# EAGLE design OneHandedPiano (EAGLE 9.6.2)
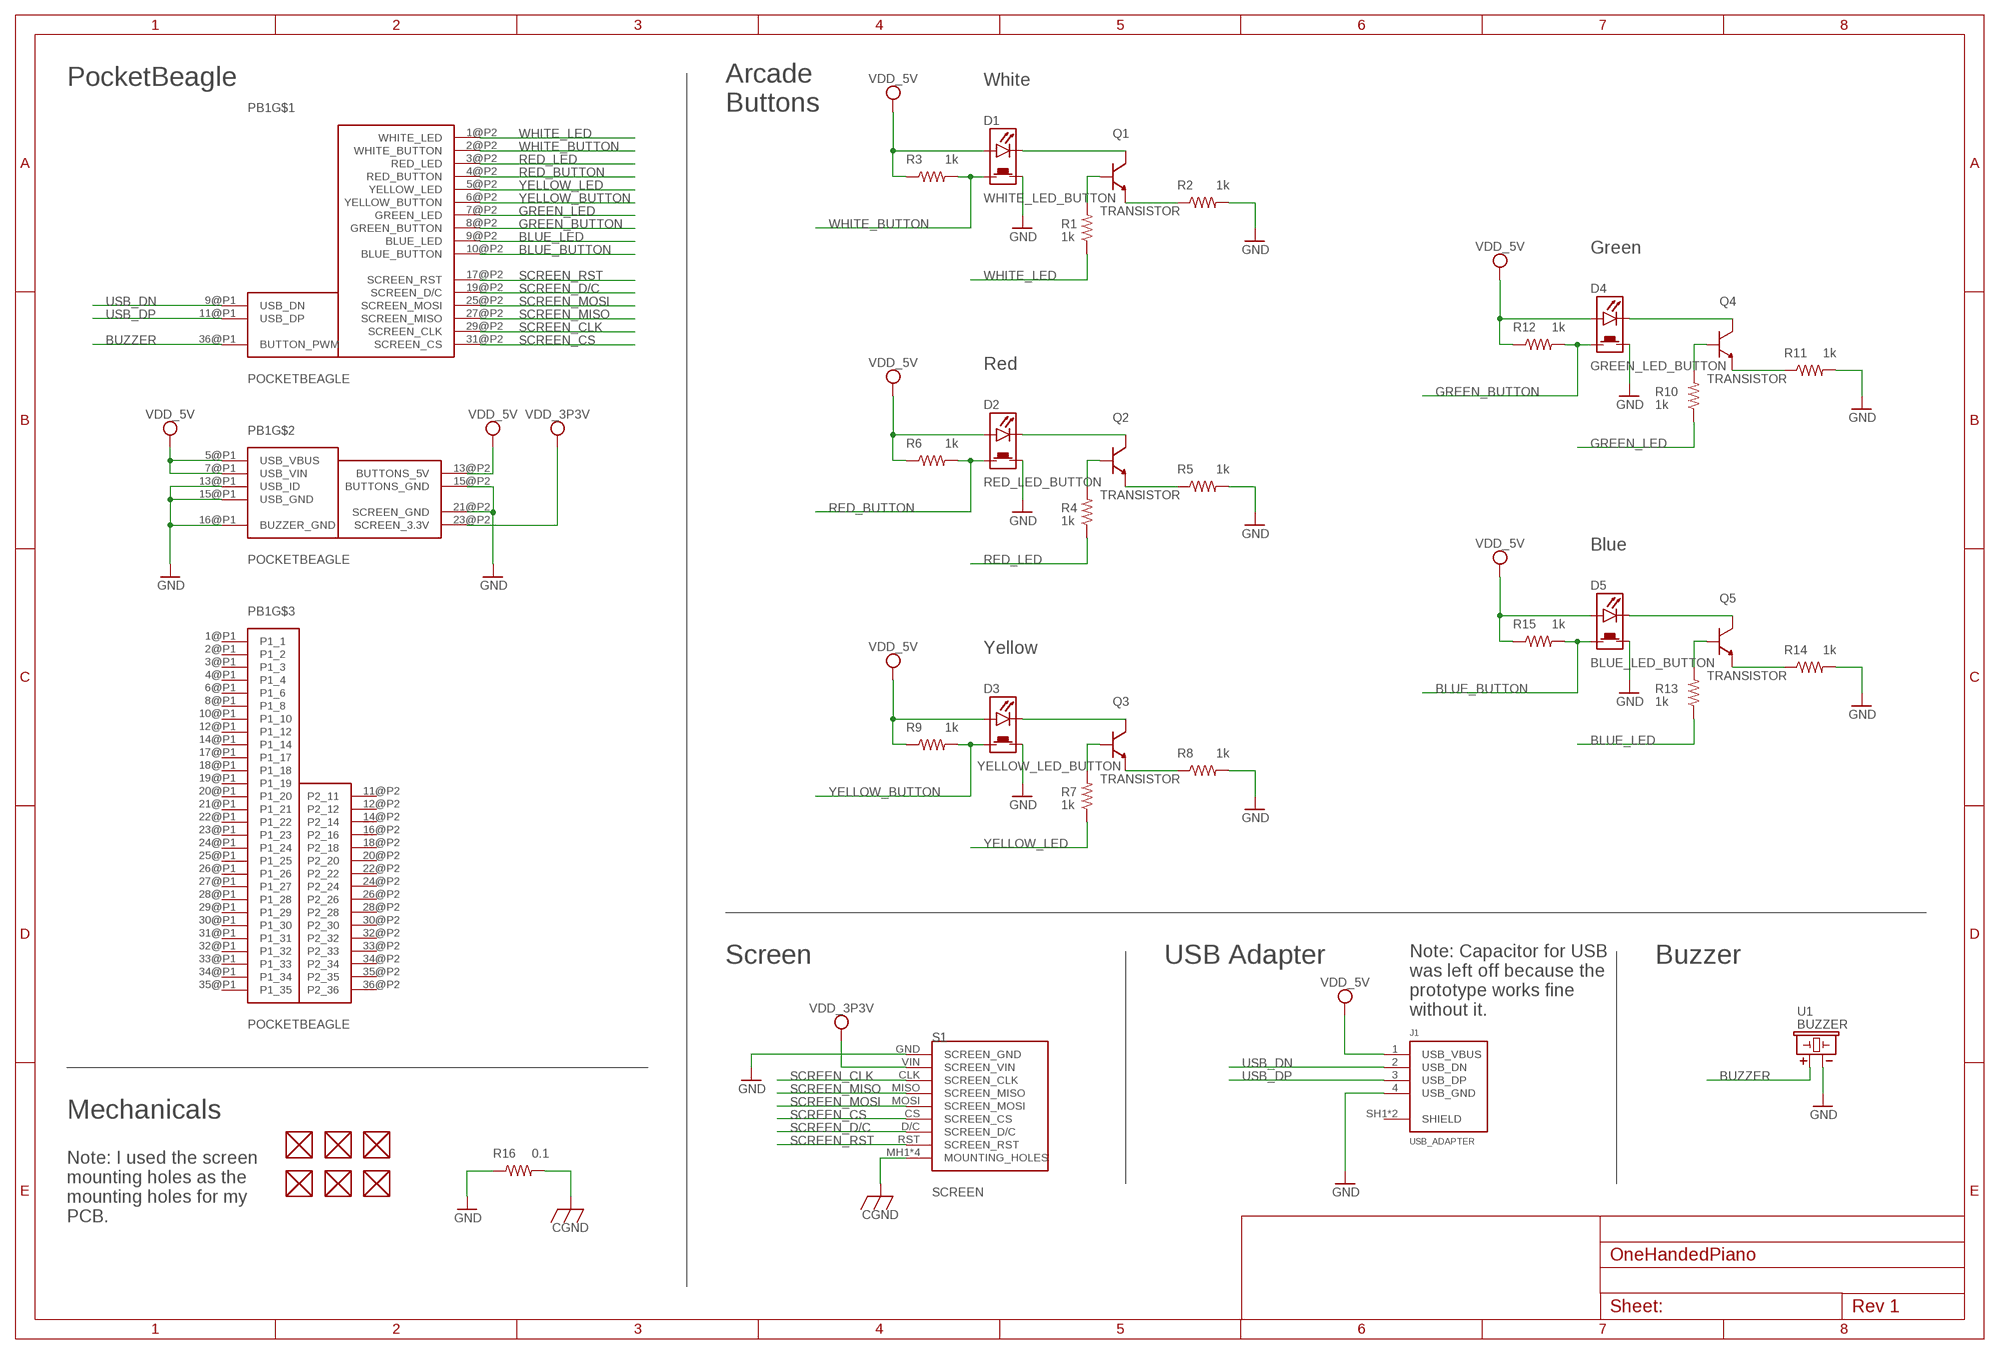
[diagram p0: schematic, sheet 1]

## Parts
D1  WHITE_LED_BUTTON  LED_BUTTON  [LED_BUTTON]
D2  RED_LED_BUTTON  LED_BUTTON  [LED_BUTTON]
D3  YELLOW_LED_BUTTON  LED_BUTTON  [LED_BUTTON]
D4  GREEN_LED_BUTTON  LED_BUTTON  [LED_BUTTON]
D5  BLUE_LED_BUTTON  LED_BUTTON  [LED_BUTTON]
FUD1  FIDUCIAL  [FIDUCIAL_40MIL]
FUD2  FIDUCIAL  [FIDUCIAL_40MIL]
FUD3  FIDUCIAL  [FIDUCIAL_40MIL]
FUD4  FIDUCIAL  [FIDUCIAL_40MIL]
FUD5  FIDUCIAL  [FIDUCIAL_40MIL]
FUD6  FIDUCIAL  [FIDUCIAL_40MIL]
J1  USB_ADAPTER  [USB_ADAPTER]
PB1  POCKETBEAGLE  [POCKETBEAGLE]
Q1  TRANSISTOR  [TRANSISTOR]
Q2  TRANSISTOR  [TRANSISTOR]
Q3  TRANSISTOR  [TRANSISTOR]
Q4  TRANSISTOR  [TRANSISTOR]
Q5  TRANSISTOR  [TRANSISTOR]
R1  1k  R_R0603  [R0603]
R2  1k  R_R0603  [R0603]
R3  1k  R_R0603  [R0603]
R4  1k  R_R0603  [R0603]
R5  1k  R_R0603  [R0603]
R6  1k  R_R0603  [R0603]
R7  1k  R_R0603  [R0603]
R8  1k  R_R0603  [R0603]
R9  1k  R_R0603  [R0603]
R10  1k  R_R0603  [R0603]
R11  1k  R_R0603  [R0603]
R12  1k  R_R0603  [R0603]
R13  1k  R_R0603  [R0603]
R14  1k  R_R0603  [R0603]
R15  1k  R_R0603  [R0603]
R16  0.1  R_R0805  [R0805]
S1  SCREEN  [SCREEN]
U1  BUZZER  [BUZZER_6.5MM]

## Nets
BLUE_BUTTON: D5.BUTTON1 PB1.10@P2(BLUE_BUTTON) R15.2
BLUE_LED: PB1.9@P2(BLUE_LED) R13.1
BUZZER: PB1.36@P1(BUTTON_PWM) U1.+
CGND: R16.2 S1.MH1(MOUNTING_HOLES) S1.MH2(MOUNTING_HOLES) S1.MH3(MOUNTING_HOLES) S1.MH4(MOUNTING_HOLES)
GND: D1.BUTTON2 D2.BUTTON2 D3.BUTTON2 D4.BUTTON2 D5.BUTTON2 J1.4(USB_GND) PB1.13@P1(USB_ID) PB1.15@P1(USB_GND) PB1.15@P2(BUTTONS_GND) PB1.16@P1(BUZZER_GND) PB1.21@P2(SCREEN_GND) R2.2 R5.2 R8.2 R11.2 R14.2 R16.1 S1.GND(SCREEN_GND) U1.-
GREEN_BUTTON: D4.BUTTON1 PB1.8@P2(GREEN_BUTTON) R12.2
GREEN_LED: PB1.7@P2(GREEN_LED) R10.1
N$1: D1.CATHODE Q1.COLLECTOR
N$2: Q1.BASE R1.2
N$3: Q1.EMITTER R2.1
N$4: D2.CATHODE Q2.COLLECTOR
N$5: Q2.BASE R4.2
N$6: Q2.EMITTER R5.1
N$7: D3.CATHODE Q3.COLLECTOR
N$8: Q3.BASE R7.2
N$9: Q3.EMITTER R8.1
N$10: D4.CATHODE Q4.COLLECTOR
N$11: Q4.BASE R10.2
N$12: Q4.EMITTER R11.1
N$13: D5.CATHODE Q5.COLLECTOR
N$14: Q5.BASE R13.2
N$15: Q5.EMITTER R14.1
RED_BUTTON: D2.BUTTON1 PB1.4@P2(RED_BUTTON) R6.2
RED_LED: PB1.3@P2(RED_LED) R4.1
SCREEN_CLK: PB1.29@P2(SCREEN_CLK) S1.CLK(SCREEN_CLK)
SCREEN_CS: PB1.31@P2(SCREEN_CS) S1.CS(SCREEN_CS)
SCREEN_D/C: PB1.19@P2(SCREEN_D/C) S1.D/C(SCREEN_D/C)
SCREEN_MISO: PB1.27@P2(SCREEN_MISO) S1.MISO(SCREEN_MISO)
SCREEN_MOSI: PB1.25@P2(SCREEN_MOSI) S1.MOSI(SCREEN_MOSI)
SCREEN_RST: PB1.17@P2(SCREEN_RST) S1.RST(SCREEN_RST)
USB_DN: J1.2(USB_DN) PB1.9@P1(USB_DN)
USB_DP: J1.3(USB_DP) PB1.11@P1(USB_DP)
VDD_3P3V: PB1.23@P2(SCREEN_3.3V) S1.VIN(SCREEN_VIN)
VDD_5V: D1.ANODE D2.ANODE D3.ANODE D4.ANODE D5.ANODE J1.1(USB_VBUS) PB1.5@P1(USB_VBUS) PB1.7@P1(USB_VIN) PB1.13@P2(BUTTONS_5V) R3.1 R6.1 R9.1 R12.1 R15.1
WHITE_BUTTON: D1.BUTTON1 PB1.2@P2(WHITE_BUTTON) R3.2
WHITE_LED: PB1.1@P2(WHITE_LED) R1.1
YELLOW_BUTTON: D3.BUTTON1 PB1.6@P2(YELLOW_BUTTON) R9.2
YELLOW_LED: PB1.5@P2(YELLOW_LED) R7.1
Unconnected: FUD1.P$1 FUD2.P$1 FUD3.P$1 FUD4.P$1 FUD5.P$1 FUD6.P$1 J1.SH1(SHIELD) J1.SH2(SHIELD) PB1.1@P1(P1_1) PB1.2@P1(P1_2) PB1.3@P1(P1_3) PB1.4@P1(P1_4) PB1.6@P1(P1_6) PB1.8@P1(P1_8) PB1.10@P1(P1_10) PB1.11@P2(P2_11) PB1.12@P1(P1_12) PB1.12@P2(P2_12) PB1.14@P1(P1_14) PB1.14@P2(P2_14) PB1.16@P2(P2_16) PB1.17@P1(P1_17) PB1.18@P1(P1_18) PB1.18@P2(P2_18) PB1.19@P1(P1_19) PB1.20@P1(P1_20) PB1.20@P2(P2_20) PB1.21@P1(P1_21) PB1.22@P1(P1_22) PB1.22@P2(P2_22) PB1.23@P1(P1_23) PB1.24@P1(P1_24) PB1.24@P2(P2_24) PB1.25@P1(P1_25) PB1.26@P1(P1_26) PB1.26@P2(P2_26) PB1.27@P1(P1_27) PB1.28@P1(P1_28) PB1.28@P2(P2_28) PB1.29@P1(P1_29) PB1.30@P1(P1_30) PB1.30@P2(P2_30) PB1.31@P1(P1_31) PB1.32@P1(P1_32) PB1.32@P2(P2_32) PB1.33@P1(P1_33) PB1.33@P2(P2_33) PB1.34@P1(P1_34) PB1.34@P2(P2_34) PB1.35@P1(P1_35) PB1.35@P2(P2_35) PB1.36@P2(P2_36)

## Notes on the sheet
- PocketBeagle | White
- Arcade
  Buttons
- Green
- Red
- Blue
- Yellow
- Screen | USB Adapter | Buzzer
- Note: Capacitor for USB 
  was left off because the 
  prototype works fine 
  without it.
- Mechanicals
- Note: I used the screen 
  mounting holes as the
  mounting holes for my
  PCB.

## Library data of the parts
D1-D5 = OneHandedPiano:LED_BUTTON: LED Arcade Buttons
FUD1-FUD6 = OneHandedPiano:FIDUCIAL
J1 = OneHandedPiano:USB_ADAPTER: CONN USB RECEPT R/A TYPE A 4POS Check availability <https://pricing.snapeda.com/parts/292303-1/TE%20Connectivity/view-part?ref=eda>; AVAILABILITY: In Stock; CENTERLINE_PITCH: 2 mm[.078 in]; CHECK_PRICES: https://www.snapeda.com/parts/292303-1/TE+Connectivity+AMP+Connectors/view-part/?ref=eda; COMMENT: 292303-1; DESCRIPTION: Type A Standard USB Connector 4 Position Right Angle Mount 1 Port | TE Connectivity 292303-1; EU_ROHS_COMPLIANCE: Compliant; MF: TE Connectivity; MP: 292303-1; NUMBER_OF_POSITIONS: 4; PACKAGE: None; PRICE: None; PRODUCT_TYPE: Connector; PURCHASE-URL: https://www.snapeda.com/api/url_track_click_mouser/?unipart_id=447501&manufacturer=TE Connectivity&part_name=292303-1&search_term=292303-1; SNAPEDA_LINK: https://www.snapeda.com/parts/292303-1/TE+Connectivity+AMP+Connectors/view-part/?ref=snap
PB1 = OneHandedPiano:POCKETBEAGLE: PocketBeagle
Q1-Q5 = OneHandedPiano:TRANSISTOR: NPN Transistor, DNBT8105-7
R1-R16 = OneHandedPiano:R_: RESISTOR, American symbol
S1 = OneHandedPiano:SCREEN: SPI Screen, Adafruit Product ID: 1770
U1 = OneHandedPiano:BUZZER: CEM-1203 Buzzer

## Board
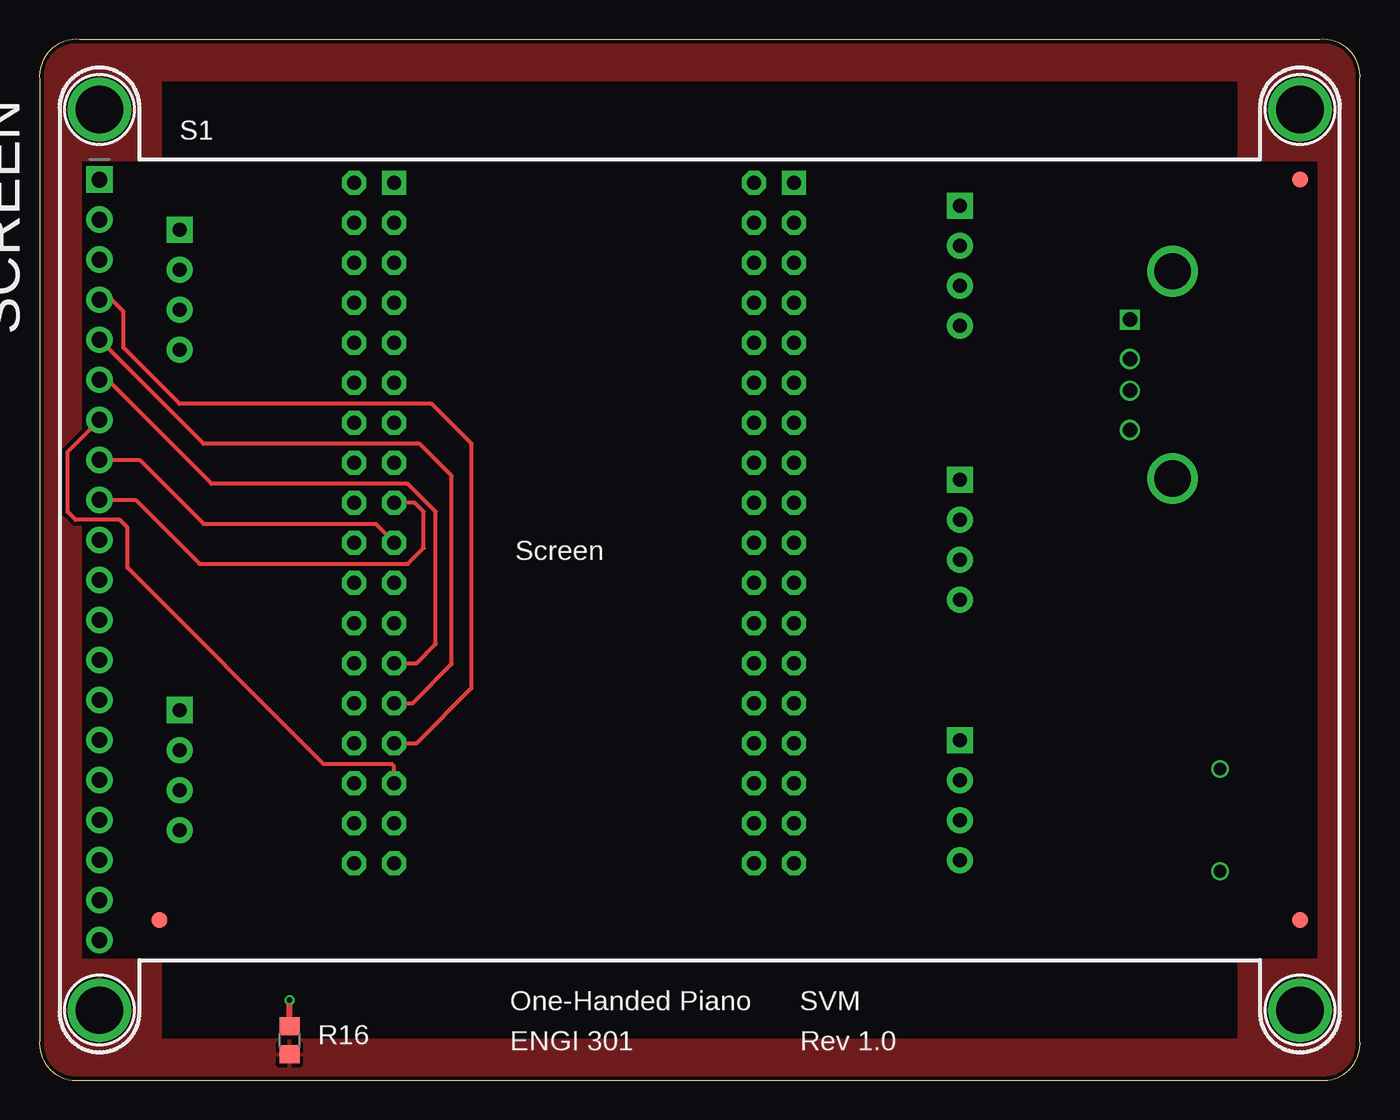
[diagram p1: board, top side]
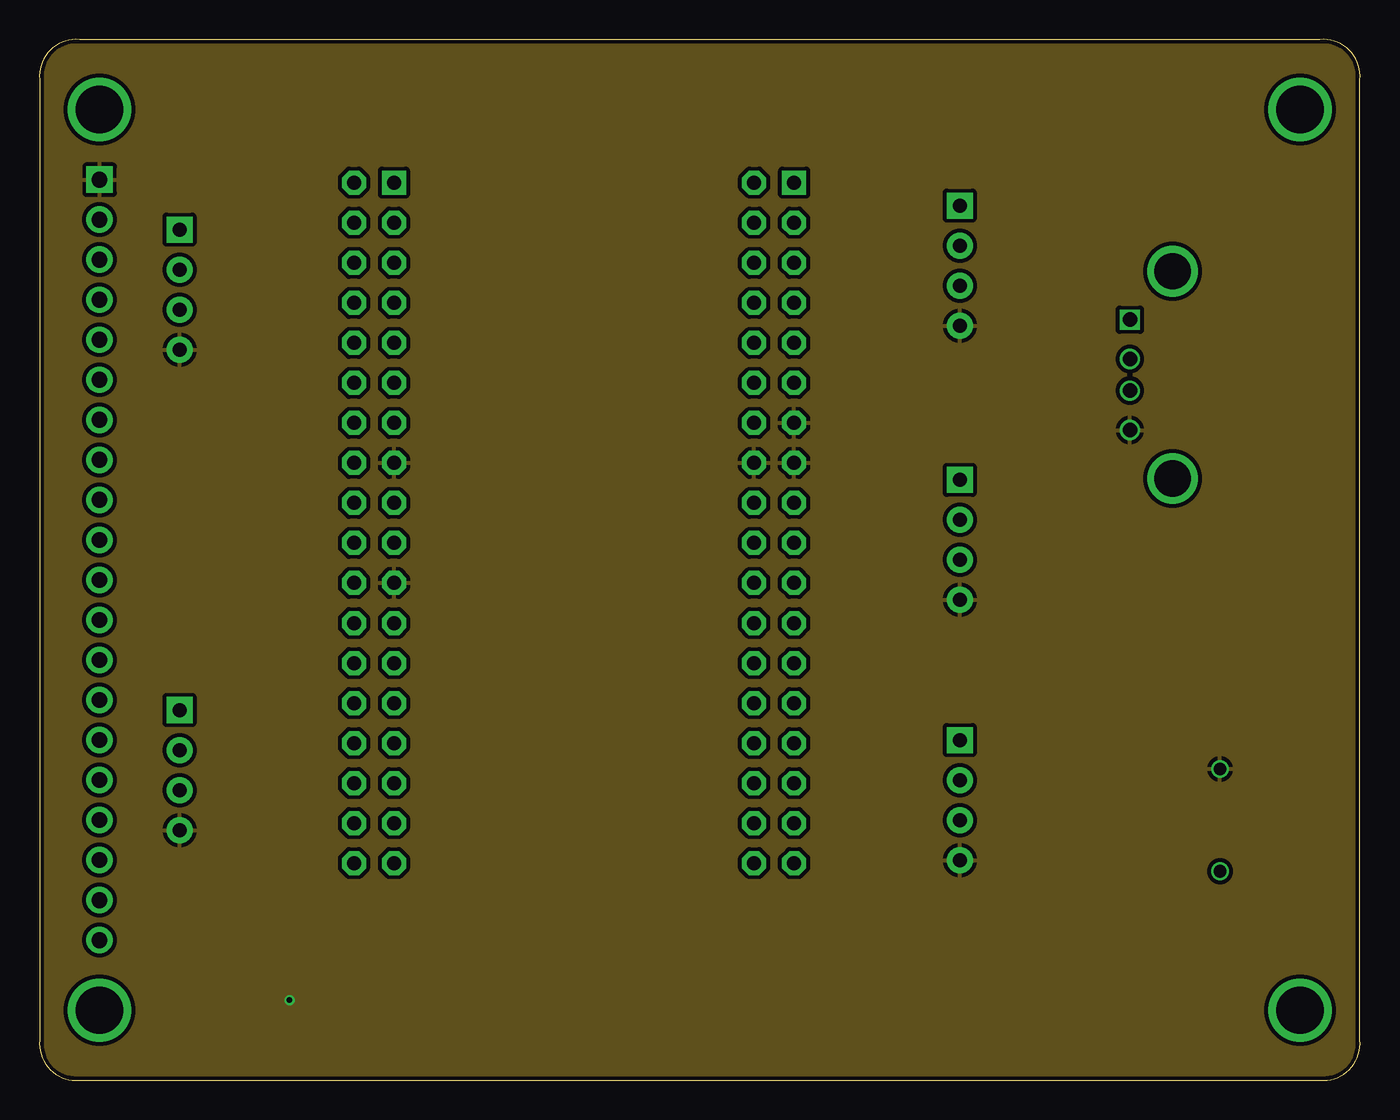
[diagram p2: board, inner layer Route2]
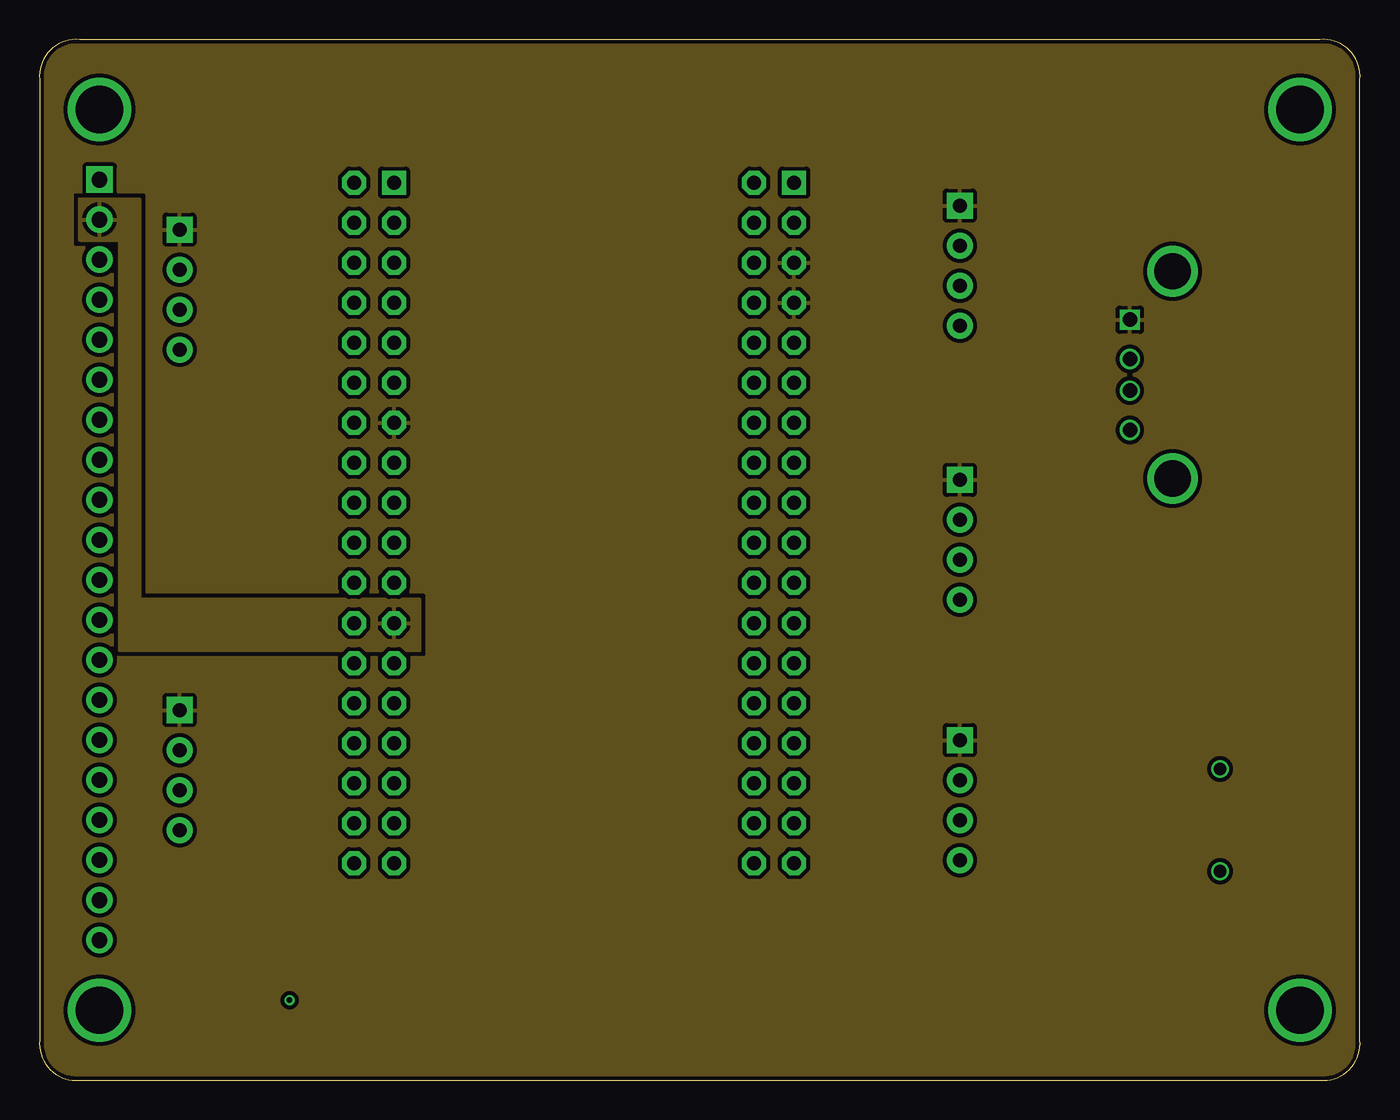
[diagram p3: board, inner layer Route15]
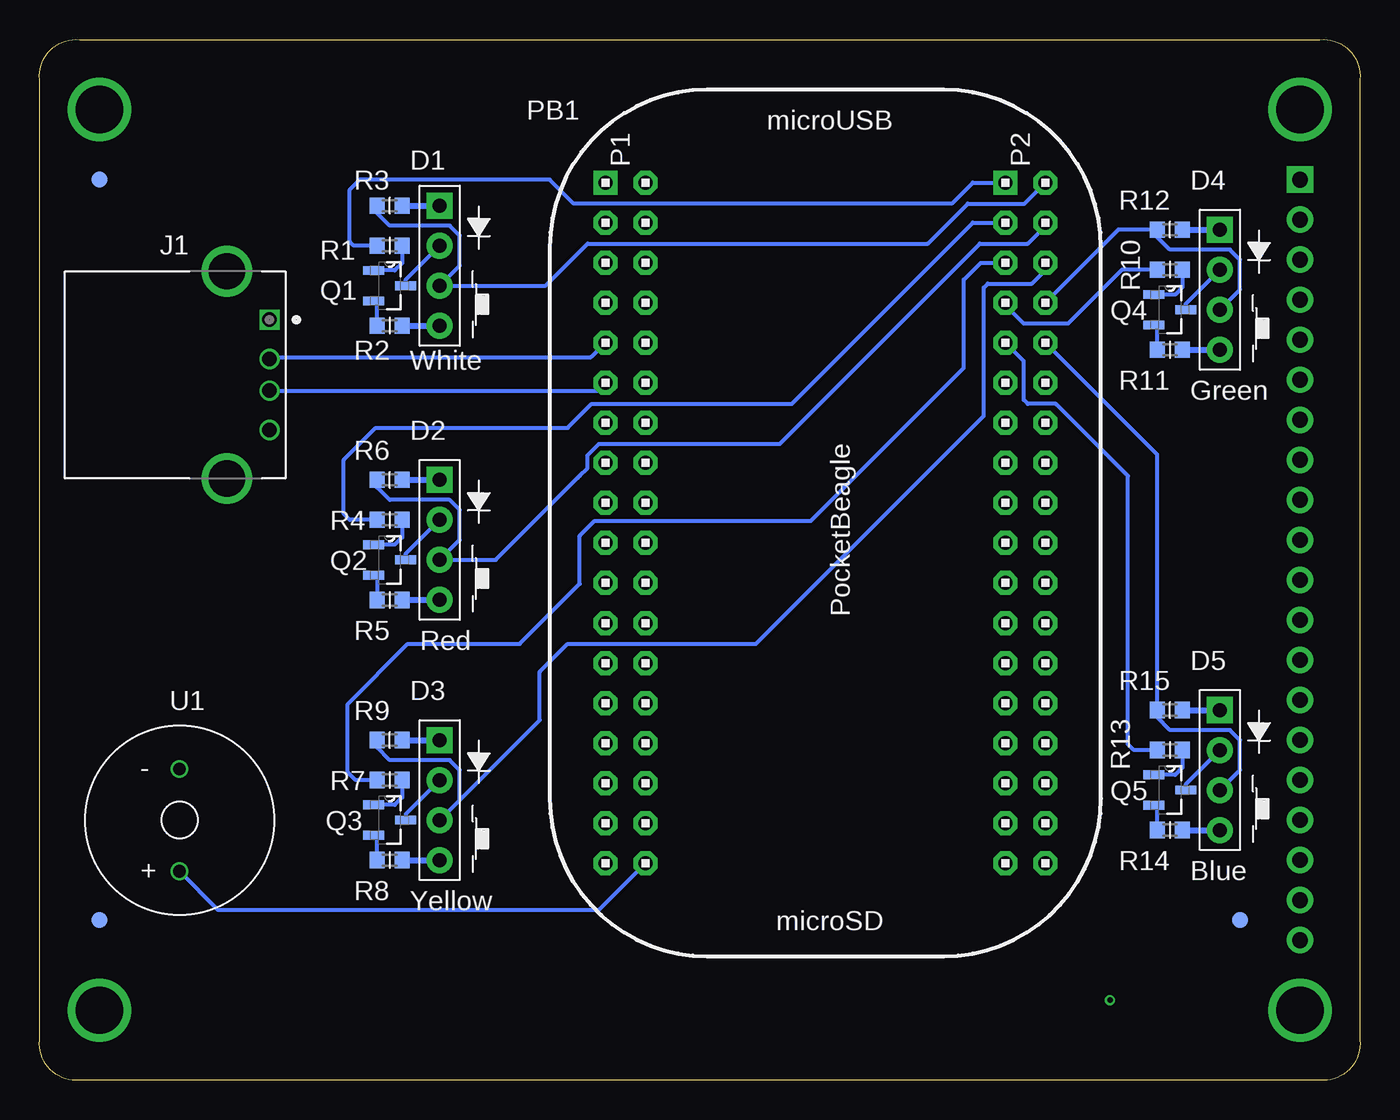
[diagram p4: board, bottom side, seen from below]

Size 83.84 x 66.06 mm. Coordinates in mm from the lower left corner, seen from the top.
Outline: 2.55,0.01 81.29,0.01 arc100 83.83,2.55 83.83,63.51 arc100 81.29,66.05 2.55,66.05 arc100 0.01,63.51 0.01,2.55 arc100 2.55,0.01
Copper layers (1*2*15*16): Top 0.035mm / dielectric 0.23mm / Route2 0.035mm / dielectric 0.93mm / Route15 0.035mm / dielectric 0.23mm / Bottom 0.035mm
Design rules "ENGI301_4lyr": minimum track width 10mil, minimum drill 12mil, track to track 10mil, track to pad 10mil, pad to pad 10mil, via to via 10mil, smd to smd 10mil, copper to edge 10mil, drill to drill 12mil, minimum pad ring 6mil, minimum via ring 6mil, stop-mask expansion 3mil, vias tented up to drill 25mil, thermal gap 10mil

### Footprints (pad centres in the part's own frame; a part is rotated, then mirrored left to right if it is on the bottom)
LED_BUTTON = drill 0.889 pad 1.651 square: ANODE 0,2.54 | drill 0.889 pad 1.651: BUTTON1 0,-2.54; BUTTON2 0,-5.08; CATHODE 0,0
FIDUCIAL_40MIL = smd 1.016 x 1.016: P$1 0,0
USB_ADAPTER = drill 0.92 square: 1 0,0 | drill 0.92: 2 2.5,0; 3 4.5,0; 4 7,0 | drill 2.3: SH1 -3.07,-2.71; SH2 10.07,-2.71
POCKETBEAGLE = drill 0.889 pad 1.524 square: 1@P1 5.91,3.53; 1@P2 5.91,28.93 | drill 0.889 pad 1.524 octagon: 2@P1 5.91,6.07; 2@P2 5.91,31.47; 3@P1 8.45,3.53; 3@P2 8.45,28.93; 4@P1 8.45,6.07; 4@P2 8.45,31.47; 5@P1 10.99,3.53; 5@P2 10.99,28.93; 6@P1 10.99,6.07; 6@P2 10.99,31.47; 7@P1 13.53,3.53; 7@P2 13.53,28.93; 8@P1 13.53,6.07; 8@P2 13.53,31.47; 9@P1 16.07,3.53; 9@P2 16.07,28.93; 10@P1 16.07,6.07; 10@P2 16.07,31.47; 11@P1 18.61,3.53; 11@P2 18.61,28.93; 12@P1 18.61,6.07; 12@P2 18.61,31.47; 13@P1 21.15,3.53; 13@P2 21.15,28.93; 14@P1 21.15,6.07; 14@P2 21.15,31.47; 15@P1 23.69,3.53; 15@P2 23.69,28.93; 16@P1 23.69,6.07; 16@P2 23.69,31.47; 17@P1 26.23,3.53; 17@P2 26.23,28.93; 18@P1 26.23,6.07; 18@P2 26.23,31.47; 19@P1 28.77,3.53; 19@P2 28.77,28.93; 20@P1 28.77,6.07; 20@P2 28.77,31.47; 21@P1 31.31,3.53; 21@P2 31.31,28.93; 22@P1 31.31,6.07; 22@P2 31.31,31.47; 23@P1 33.85,3.53; 23@P2 33.85,28.93; 24@P1 33.85,6.07; 24@P2 33.85,31.47; 25@P1 36.39,3.53; 25@P2 36.39,28.93; 26@P1 36.39,6.07; 26@P2 36.39,31.47; 27@P1 38.93,3.53; 27@P2 38.93,28.93; 28@P1 38.93,6.07; 28@P2 38.93,31.47; 29@P1 41.47,3.53; 29@P2 41.47,28.93; 30@P1 41.47,6.07; 30@P2 41.47,31.47; 31@P1 44.01,3.53; 31@P2 44.01,28.93; 32@P1 44.01,6.07; 32@P2 44.01,31.47; 33@P1 46.55,3.53; 33@P2 46.55,28.93; 34@P1 46.55,6.07; 34@P2 46.55,31.47; 35@P1 49.09,3.53; 35@P2 49.09,28.93; 36@P1 49.09,6.07; 36@P2 49.09,31.47
TRANSISTOR = smd 1.321 x 0.559: BASE -1.016,0.965; COLLECTOR 1.016,0; EMITTER -1.016,-0.965
R0603 = smd 0.95 x 1.031: 1 -0.8,0; 2 0.8,0
R0805 = smd 1.143 x 1.27: 1 -0.889,0; 2 0.889,0
SCREEN = drill 1 pad 1.676: 3@JP2 -19.05,-38.1; 10@JP2 -1.27,-38.1; 11@JP2 1.27,-38.1; 12@JP2 3.81,-38.1; 13@JP2 6.35,-38.1; 14@JP2 8.89,-38.1; 15@JP2 11.43,-38.1; 16@JP2 13.97,-38.1; 17@JP2 16.51,-38.1; 18@JP2 19.05,-38.1; 19@JP2 21.59,-38.1; 20@JP2 24.13,-38.1; CLK -16.51,-38.1; CS -8.89,-38.1; D/C -6.35,-38.1; MISO -13.97,-38.1; MOSI -11.43,-38.1; RST -3.81,-38.1; VIN -21.59,-38.1 | drill 1 pad 1.676 square: GND -24.13,-38.1 | drill 3 pad 3.6: MH1 -28.575,-38.1; MH2 -28.575,38.1; MH3 28.575,-38.1; MH4 28.575,38.1
BUZZER_6.5MM = drill 0.8: + 0,-3.25; - 0,3.25

### Placement (x,y rotation side)
D1  58.43,52.97 0 bottom
D2  58.43,35.57 0 bottom
D3  58.43,19.06 0 bottom
D4  8.9,51.44 0 bottom
D5  8.9,20.96 0 bottom
FUD1  80.02,57.16 0 top
FUD2  80.02,10.17 0 top
FUD3  80.02,57.16 0 bottom
FUD4  7.63,10.17 0 bottom
FUD5  80.02,10.17 0 bottom
FUD6  7.63,10.17 0 top
J1  69.22,48.27 270 bottom
PB1  51.44,62.87 270 bottom
Q1  61.6,50.43 0 bottom
Q2  61.6,33.03 0 bottom
Q3  61.6,16.52 0 bottom
Q4  12.07,48.9 0 bottom
Q5  12.07,18.42 0 bottom
R1  61.6,52.97 0 bottom
R2  61.6,47.89 0 bottom
R3  61.6,55.51 180 bottom
R4  61.6,35.57 0 bottom
R5  61.6,30.49 0 bottom
R6  61.6,38.11 180 bottom
R7  61.6,19.06 0 bottom
R8  61.6,13.98 0 bottom
R9  61.6,21.6 180 bottom
R10  12.07,51.44 0 bottom
R11  12.07,46.36 0 bottom
R12  12.07,53.98 180 bottom
R13  12.07,20.96 0 bottom
R14  12.07,15.88 0 bottom
R15  12.07,23.5 180 bottom
R16  15.88,2.55 270 top
S1  41.92,33.03 270 top
U1  74.94,16.52 0 bottom

### Tracks (layer width: path | path; a pad name or v marks a point on that pad's centre or on a via)
BLUE_BUTTON
  Bottom 0.254: D5.BUTTON1 7.63,19.69 7.63,21.6 8.26,22.23 12.07,22.23 12.87,23.03 R15.2 12.87,39.7 PB1.10@P2
BLUE_LED
  Bottom 0.254: PB1.9@P2 21.34,45.63 21.34,43.19 21.09,42.93 19.31,42.93 14.74,38.36 14.74,21.34 14.36,20.96 R13.1
BUZZER
  Bottom 0.254: PB1.36@P1 48.35,10.8 72.47,10.8 U1.+
CGND
  pour Top: -2.53,33.03 2.55,33.03 2.55,7.63 7.63,7.63 7.63,2.55 76.21,2.55 76.21,7.63 81.29,7.63 81.29,33.03 86.37,33.03 86.37,-2.53 -2.53,-2.53
  pour Top: -2.53,33.03 -2.53,68.59 86.37,68.59 86.37,33.03 81.29,33.03 81.29,58.43 76.21,58.43 76.21,63.51 7.63,63.51 7.63,58.43 2.55,58.43 2.55,33.03
GND  (via drill 0.35)
  Top 0.381: R16.1 v15.88,5.09
  Bottom 0.381: R8.2 D3.BUTTON2 | R5.2 D2.BUTTON2 | R2.2 D1.BUTTON2 | R14.2 D5.BUTTON2 | R11.2 D4.BUTTON2
  pour Route2: -5.07,71.13 -5.07,-5.07 88.91,-5.07 88.91,71.13
GREEN_BUTTON
  Bottom 0.254: D4.BUTTON1 7.63,50.17 7.63,52.08 8.26,52.71 12.07,52.71 12.87,53.51 R12.2 15.33,53.98 PB1.8@P2
GREEN_LED
  Bottom 0.254: R10.1 15.12,51.44 18.55,48.01 21.34,48.01 22.51,49.18 PB1.7@P2
N$1
  Bottom 0.254: Q1.COLLECTOR 60.59,50.81 D1.CATHODE
N$2
  Bottom 0.254: R1.2 60.8,51.86 61.27,51.39 Q1.BASE
N$3
  Bottom 0.254: R2.1 62.4,49.25 Q1.EMITTER
N$4
  Bottom 0.254: Q2.COLLECTOR 60.59,33.41 D2.CATHODE
N$5
  Bottom 0.254: R4.2 60.8,34.46 61.27,33.99 Q2.BASE
N$6
  Bottom 0.254: Q2.EMITTER 62.4,31.85 R5.1
N$7
  Bottom 0.254: D3.CATHODE 60.59,16.9 Q3.COLLECTOR
N$8
  Bottom 0.254: R7.2 60.8,17.95 61.27,17.48 Q3.BASE
N$9
  Bottom 0.254: R8.1 62.4,15.34 Q3.EMITTER
N$10
  Bottom 0.254: Q4.COLLECTOR 11.06,49.28 D4.CATHODE
N$11
  Bottom 0.254: R10.2 11.27,50.34 11.74,49.87 Q4.BASE
N$12
  Bottom 0.254: R11.1 12.87,47.72 Q4.EMITTER
N$13
  Bottom 0.254: Q5.COLLECTOR 11.06,18.8 D5.CATHODE
N$14
  Bottom 0.254: R13.2 11.27,19.86 11.74,19.39 Q5.BASE
N$15
  Bottom 0.254: R14.1 12.87,17.24 Q5.EMITTER
RED_BUTTON
  Bottom 0.254: R6.2 62.4,37.64 61.6,36.84 57.79,36.84 57.16,36.2 57.16,34.3 D2.BUTTON1 54.87,33.03 49.67,38.24 49.54,38.36 49.06,38.84 49.06,39.66 48.32,40.39 36.84,40.39 24.14,53.09 21.09,53.09 19.97,54.21 PB1.4@P2
RED_LED
  Bottom 0.254: PB1.3@P2 24.59,54.42 36.08,42.93 48.78,42.93 50.3,41.41 62.49,41.41 64.52,39.38 64.52,35.95 64.14,35.57 R4.1
SCREEN_CLK
  Top 0.254: S1.CLK 4.58,49.54 5.34,48.78 5.34,46.49 8.9,42.93 24.9,42.93 27.44,40.39 27.44,24.9 23.94,21.4 PB1.29@P2
SCREEN_CS
  Top 0.254: PB1.31@P2 22.51,19.92 22.36,20.07 18.04,20.07 5.6,32.52 5.6,35.06 5.09,35.57 2.29,35.57 1.79,36.08 1.79,39.89 S1.CS
SCREEN_D/C
  Top 0.254: S1.D/C 6.36,39.38 10.42,35.31 21.34,35.31 22.51,34.15 PB1.19@P2
SCREEN_MISO
  Top 0.254: S1.MISO 10.42,40.39 24.14,40.39 26.17,38.36 26.17,26.42 23.69,23.94 PB1.27@P2
SCREEN_MOSI
  Top 0.254: S1.MOSI 4.33,44.46 10.93,37.85 23.38,37.85 25.15,36.08 25.15,27.69 23.94,26.48 PB1.25@P2
SCREEN_RST
  Top 0.254: S1.RST 6.1,36.84 10.17,32.77 23.38,32.77 24.39,33.79 24.39,36.08 23.83,36.64 PB1.17@P2
USB_DN
  Bottom 0.254: PB1.9@P1 48.82,45.9 69.1,45.9 J1.2
USB_DP
  Bottom 0.254: J1.3 48.41,43.77 PB1.11@P1
VDD_3P3V
  pour Route15: 6.36,55.89 2.55,55.89 2.55,53.35 5.09,53.35 5.09,27.31 24.14,27.31 24.14,30.49 6.36,30.49
VDD_5V
  Bottom 0.381: R9.1 D3.ANODE | R6.1 D2.ANODE | R3.1 D1.ANODE | R15.1 D5.ANODE | R12.1 D4.ANODE
  pour Route15 (rank 6): -7.61,73.67 -7.61,-7.61 91.45,-7.61 91.45,73.67
WHITE_BUTTON
  Bottom 0.254: R3.2 62.4,55.04 61.6,54.24 57.79,54.24 57.16,53.6 57.16,51.7 D1.BUTTON1 51.7,50.43 49.03,53.09 27.44,53.09 24.9,55.63 21.3,55.63 PB1.2@P2
WHITE_LED
  Bottom 0.254: R1.1 63.89,52.97 64.14,53.22 64.14,56.52 63.51,57.16 51.44,57.16 49.92,55.63 25.92,55.63 24.59,56.96 PB1.1@P2
YELLOW_BUTTON
  Bottom 0.254: R9.2 62.4,21.13 61.6,20.33 57.79,20.33 57.16,19.69 57.16,17.79 D3.BUTTON1 52.08,22.87 52.08,25.92 50.3,27.69 38.36,27.69 23.88,42.17 23.88,50.3 23.63,50.55 20.84,50.55 19.97,51.42 PB1.6@P2
YELLOW_LED
  Bottom 0.254: R7.1 63.76,19.06 64.27,19.57 64.27,23.88 60.46,27.69 53.35,27.69 49.54,31.5 49.54,34.55 48.59,35.5 34.87,35.5 25.15,45.22 25.15,50.81 24.08,51.88 PB1.5@P2

### Text on the board
tPlace: One-Handed Piano | SVM | ENGI 301 | Rev 1.0
bPlace: White | Green | Red | Blue | Yellow